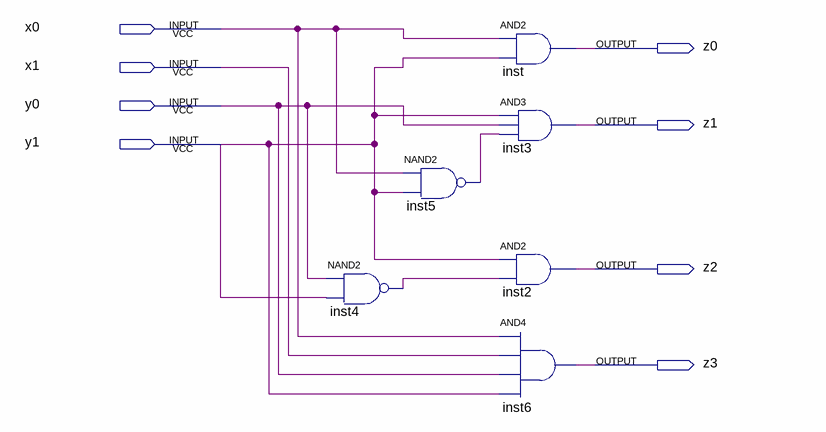
[diagram p0: schematic sheet]
// Quartus schematic PruebaBDF.bdf as structural Verilog: 6 symbols, 8 pins
module PruebaBDF (
  input  x0,
  input  x1,
  input  y0,
  input  y1,
  output z0,
  output z1,
  output z2,
  output z3
);

  wire inst4_out, inst5_out;

  nand inst4 (inst4_out, y0, y1);
  nand inst5 (inst5_out, x0, y1);
  and inst (z0, x0, y1);
  and inst3 (z1, y1, y0, inst5_out);
  and inst2 (z2, y1, inst4_out);
  and inst6 (z3, x0, x1, y0, y1);
endmodule
